# EAGLE design Multimodal_v4 (EAGLE 8.2.2)
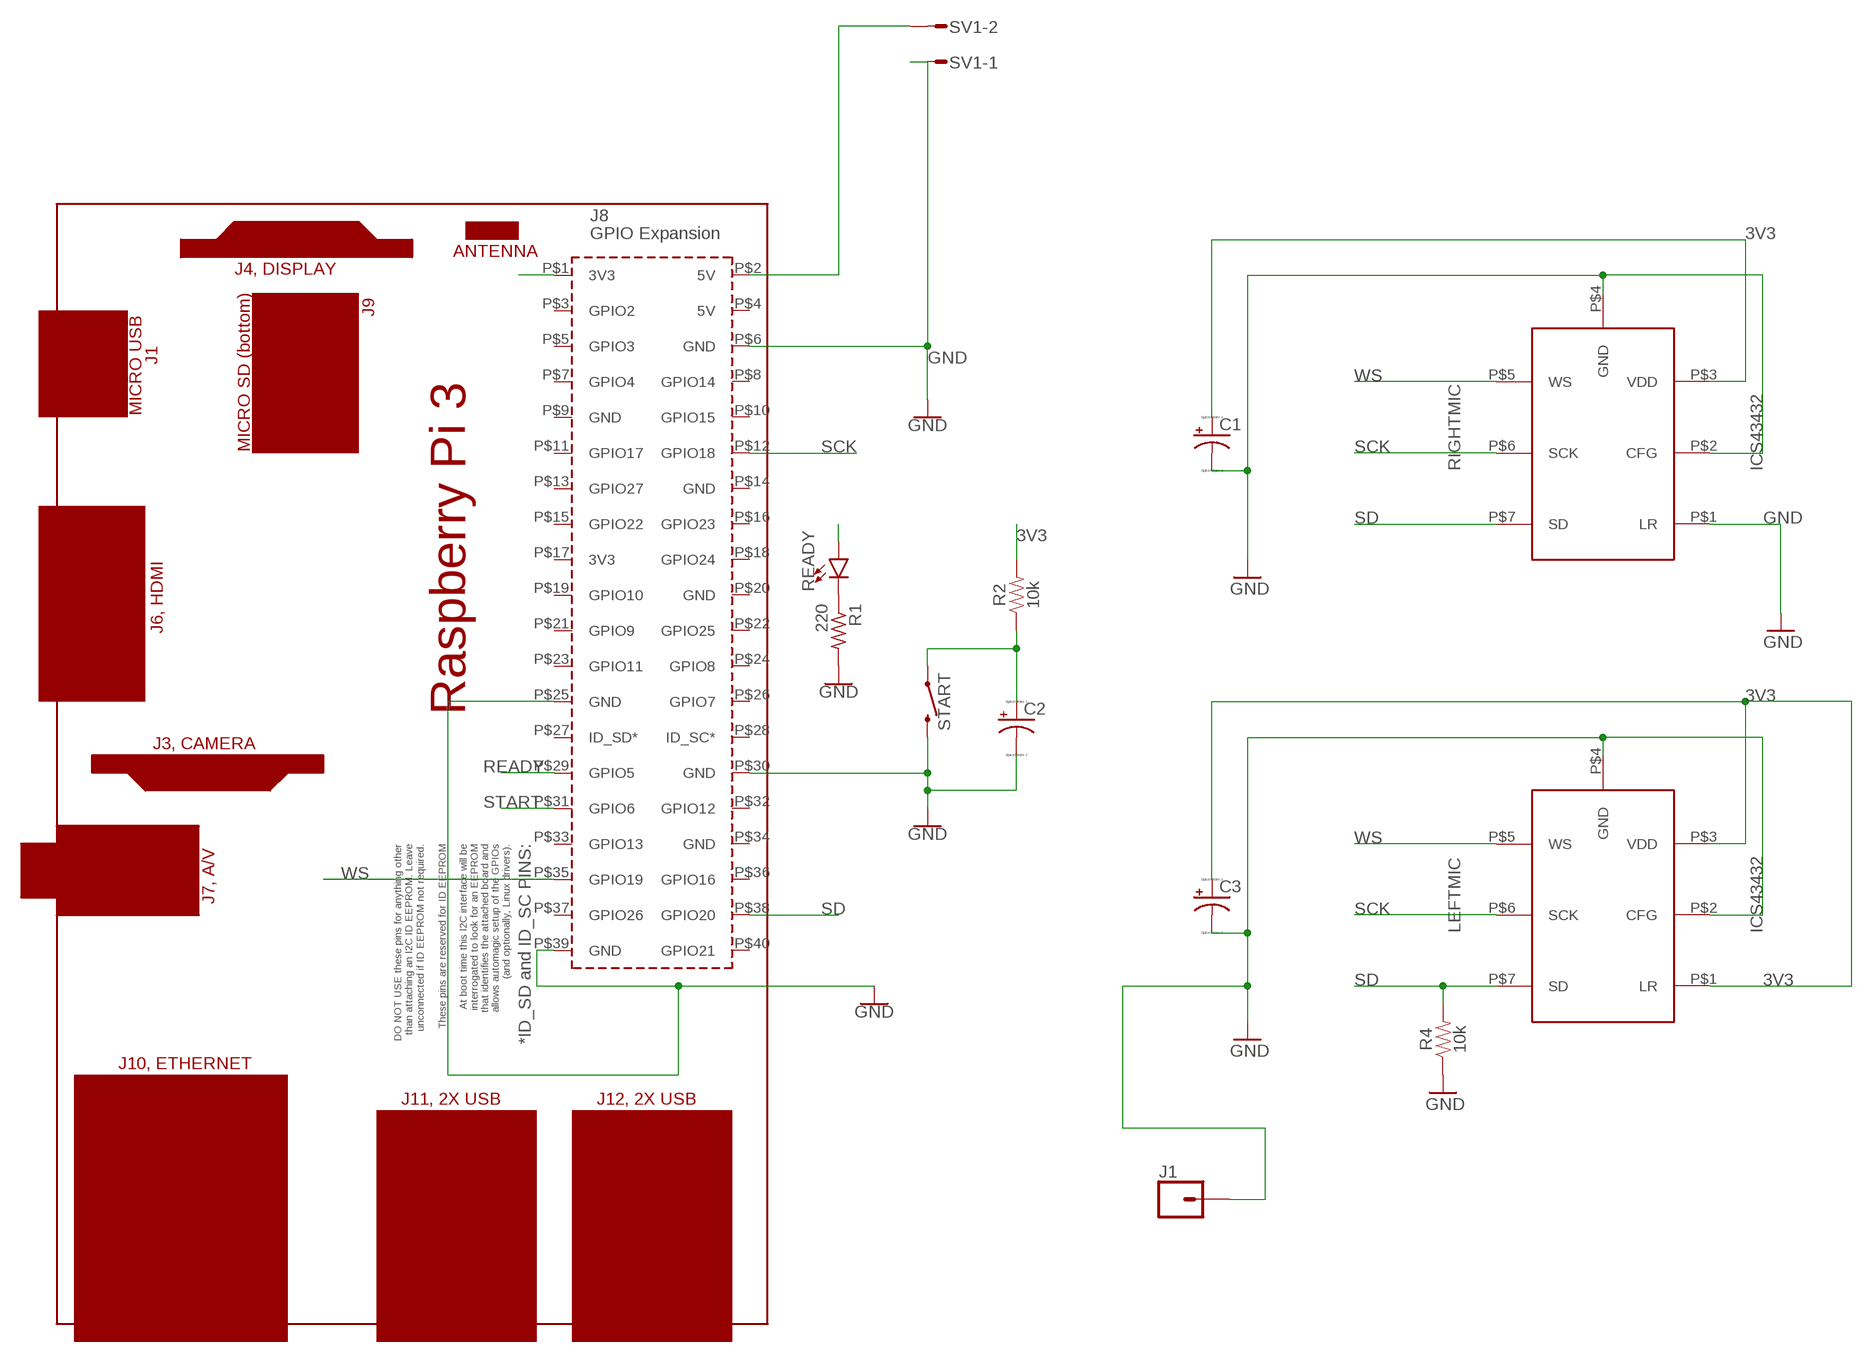
[diagram p0: schematic, sheet 1]

## Parts
C1  CPOL-USE2.5-5  [E2,5-5]
C2  CPOL-USE2.5-5  [E2,5-5]
C3  CPOL-USE2.5-5  [E2,5-5]
J1  CONN_01  [1X01]
LEFTMIC  ICS43432  [ICS43432]
PCB1  RPI3_40_PIN  [40_PIN]
R1  220  R-US_0207/7  [0207/7]
R2  10k  10KOHM-HORIZ_KIT-1/4W-5%  [AXIAL-0.3-KIT]
R4  10k  10KOHM-HORIZ_KIT-1/4W-5%  [AXIAL-0.3-KIT]
READY  LED3MM  [LED_3MM]
RIGHTMIC  ICS43432  [ICS43432]
START  MOMENTARY-SWITCH-SPST-PTH-6.0MM  [TACTILE_SWITCH_PTH_6.0MM]
SV1  L02P  [L02P]

## Nets
3V3: C1.+ C3.+ LEFTMIC.P$1(LR) LEFTMIC.P$3(VDD) PCB1.P$1(3V3) R2.P$2 RIGHTMIC.P$3(VDD)
GND: C1.- C2.- C3.- J1.1 LEFTMIC.P$2(CFG) LEFTMIC.P$4(GND) PCB1.P$6(GND) PCB1.P$25(GND) PCB1.P$30(GND) PCB1.P$39(GND) R1.2 R4.P$1 RIGHTMIC.P$1(LR) RIGHTMIC.P$2(CFG) RIGHTMIC.P$4(GND) START.3 SV1.1
N$1: R1.1 READY.K(C)
N$2: PCB1.P$2(5V) SV1.2
READY: PCB1.P$29(GPIO5) READY.A
SCK: LEFTMIC.P$6(SCK) PCB1.P$12(GPIO18) RIGHTMIC.P$6(SCK)
SD: LEFTMIC.P$7(SD) PCB1.P$38(GPIO20) R4.P$2 RIGHTMIC.P$7(SD)
START: C2.+ PCB1.P$31(GPIO6) R2.P$1 START.1
WS: LEFTMIC.P$5(WS) PCB1.P$35(GPIO19) RIGHTMIC.P$5(WS)
Unconnected: PCB1.P$3(GPIO2) PCB1.P$4(5V) PCB1.P$5(GPIO3) PCB1.P$7(GPIO4) PCB1.P$8(GPIO14) PCB1.P$9(GND) PCB1.P$10(GPIO15) PCB1.P$11(GPIO17) PCB1.P$13(GPIO27) PCB1.P$14(GND) PCB1.P$15(GPIO22) PCB1.P$16(GPIO23) PCB1.P$17(3V3) PCB1.P$18(GPIO24) PCB1.P$19(GPIO10) PCB1.P$20(GND) PCB1.P$21(GPIO9) PCB1.P$22(GPIO25) PCB1.P$23(GPIO11) PCB1.P$24(GPIO8) PCB1.P$26(GPIO7) PCB1.P$27(ID_SD*) PCB1.P$28(ID_SC*) PCB1.P$32(GPIO12) PCB1.P$33(GPIO13) PCB1.P$34(GND) PCB1.P$36(GPIO16) PCB1.P$37(GPIO26) PCB1.P$40(GPIO21)

## Library data of the parts
C1-C3 = resistor:CPOL-US: POLARIZED CAPACITOR, American symbol
J1 = SparkFun-Connectors:CONN_01: Single connection point. Often used as Generic Header-pin footprint for 0.1 inch spaced/style header connections On any of the 0.1 inch spaced packages, you can populate with these: Break Away Headers - Straight <https://www.sparkfun.com/products/116> (PRT-00116) Break Away Male Headers - Right Angle <https://www.sparkfun.com/products/553> (PRT-00553) Female Headers <https://www.sparkfun.com/products/115> (PRT-00115) Break Away Headers - Machine Pin <https://www.sparkfun.com/products/117> (PRT-00117) Break Away Female Headers - Swiss Machine Pin <https://www.sparkfun.com/products/743> (PRT-00743) This device is also useful as a general connection point to wire up your design to another part of your project. Our various solder wires solder well into these plated through hole pads. Hook-Up Wire - Assortment (Stranded, 22 AWG) <https://www.sparkfun.com/products/11375> (PRT-11375) Hook-Up Wire - Assortment (Solid Core, 22 AWG) <https://www.sparkfun.com/products/11367> (PRT-11367) View the entire wire category on our website here <https://www.sparkfun.com/categories/141> Special notes: SMTSO-256-ET is a "flush mount" nut for a 4-40 screw. We mostly use this on specialty testbeds; it is a nice way to connect hardware to your PCB at an adjustable hieght. Also note, the SNAP packages are for using a snappable style connector. We sell a baggie of snaps and they are also used on two LilyPad designs: Snap Assortment - 30 pack (male and female) <https://www.sparkfun.com/products/11347> (DEV-11347) LilyPad Arduino SimpleSnap <https://www.sparkfun.com/products/10941> (DEV-10941) LilyPad SimpleSnap Protoboard <https://www.sparkfun.com/products/10940> (DEV-10940)
LEFTMIC RIGHTMIC = Kris:ICS43432
PCB1 = e14_Rpi3_RevA:RPI3_40_PIN: Device for Raspberry Pi 3 without an associated 40 pin header package created by Dave Young for www.element14.com.
R1 = resistor:R-US_: RESISTOR, American symbol
R2 R4 = SparkFun-Resistors:10KOHM: 10kΩ resistor A resistor is a passive two-terminal electrical component that implements electrical resistance as a circuit element. Resistors act to reduce current flow, and, at the same time, act to lower voltage levels within circuits. - Wikipedia; PROD_ID: RES-09435
READY = SparkFun-LED:LED: LED (Generic) Standard schematic elements and footprints for 5mm, 3mm, 1206, and 0603 sized LEDs. Generic LEDs with no color specified.; PROD_ID: DIO-08794
START = SparkFun-Switches:MOMENTARY-SWITCH-SPST: Momentary Switch (Pushbutton) - SPST Normally-open (NO) SPST momentary switches (buttons, pushbuttons). Variants PTH-12MM - 12mm square, through-hole Momentary Pushbutton Switch - 12mm Square <https://www.sparkfun.com/products/9190> (COM-09190) PTH-6.0MM, PTH-6.0MM-KIT - 6.0mm square, through-hole Mini Pushbutton Switch <https://www.sparkfun.com/products/97> (COM-00097) KIT package intended for soldering kit's - only one side of pads' copper is exposed. PTH-RIGHT-ANGLE-KIT - Right-angle, through-hole Right Angle Tactile Button <https://www.sparkfun.com/products/10791> - Used on SparkFun BigTime Watch Kit <https://www.sparkfun.com/products/11734> SMD-12MM - 12mm square, surface-mount Tactile Button - SMD (12mm) <https://www.sparkfun.com/products/12993> (COM-12993) Used on SparkFun PicoBoard <https://www.sparkfun.com/products/11888> SMD-4.5MM - 4.5mm Square Trackball Switch Used on SparkFun Blackberry Trackballer Breakout <https://www.sparkfun.com/products/13169> SMD-4.6MMX2.8MM - 4.60mm x 2.80mm, surface mount Used on SparkFun SAMD21 Mini Breakout <https://www.sparkfun.com/products/13664> SMD-5.2MM, SMD-5.2-REDUNDANT - 5.2mm square, surface-mount Mini Pushbutton Switch - SMD <https://www.sparkfun.com/products/8720> (COM-08720) Used on Arduino Pro Mini <https://www.sparkfun.com/products/11114> REDUNDANT package connects both switch circuits together SMD-6.0X3.5MM - 6.0 x 3.5mm, surface mount Momentary Reset Switch SMD <https://www.sparkfun.com/products/8229> (COM-08229) SMD-6.2MM-TALL - 6.2mm square, surface mount Tactile Button - SMD (6mm) <https://www.sparkfun.com/products/12992> Used on SparkFun Digital Sandbox <https://www.sparkfun.com/products/12651> SMD-RIGHT-ANGLE - Right-angle, surface mount Used on SparkFun Block for Intel® Edison - Arduino <https://www.sparkfun.com/products/13036>; PROD_ID: SWCH-08441; SF_SKU: COM-00097
SV1 = con-amp-mt:L02P: AMP MT CONNECTOR; OC_FARNELL: unknown; OC_NEWARK: unknown

## Net classes
0 default: clearance 0.205 mm

## Board
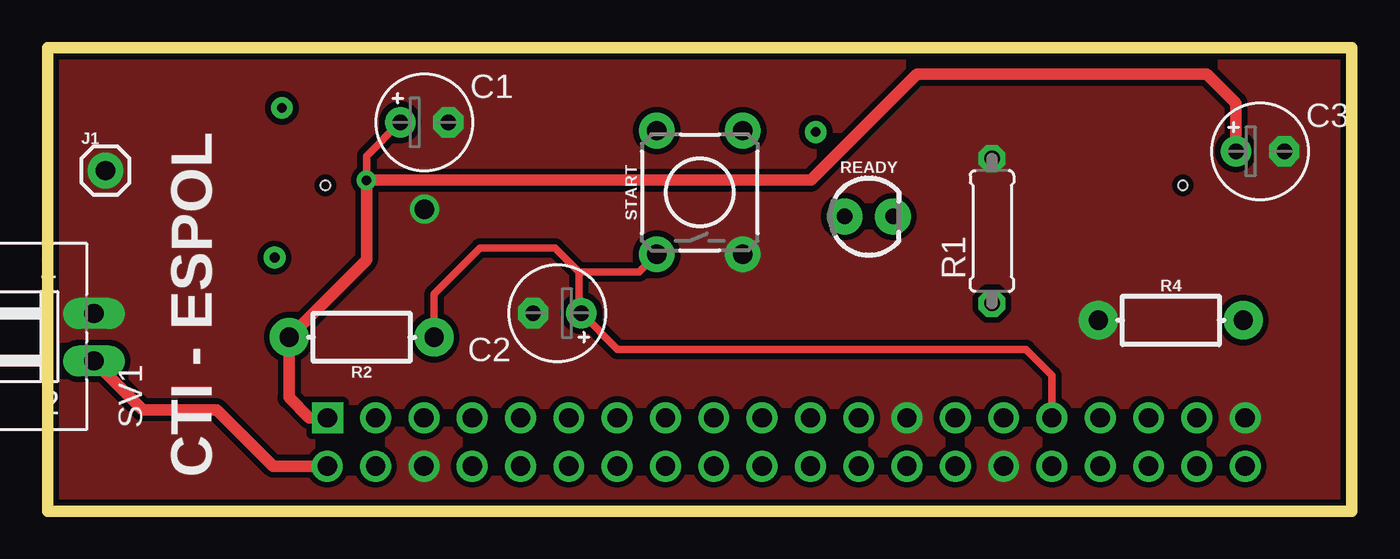
[diagram p1: board, top side]
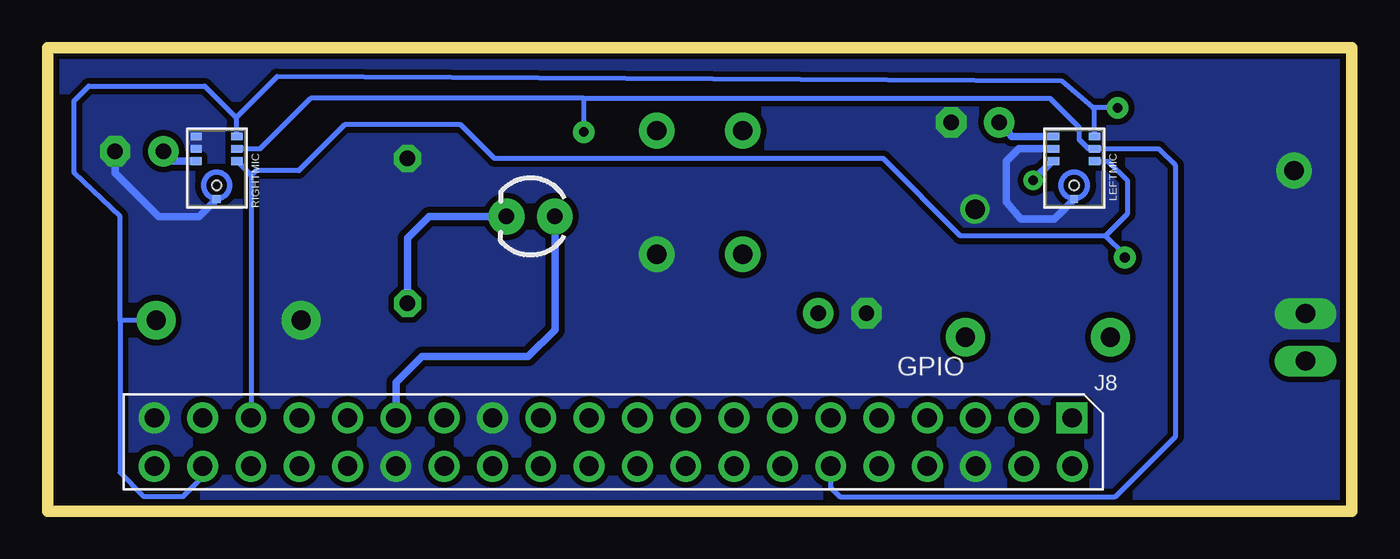
[diagram p2: board, bottom side, seen from below]

Size 68.58 x 24.38 mm. Coordinates in mm from the lower left corner, seen from the top.
Outline: 0,24.38 68.58,24.38 68.58,0 0,0 0,24.38
Copper layers (1*16): Top 0.035mm / dielectric 1.5mm / Bottom 0.035mm
Design rules "SparkFun": minimum track width 8mil, minimum drill 20mil, track to track 8mil, track to pad 8mil, pad to pad 8mil, via to via 8mil, smd to smd 8mil, copper to edge 8mil, drill to drill 8mil, minimum pad ring 12mil, minimum via ring 10mil, stop-mask expansion 4mil, vias tented up to drill 20mil, thermal gap 10mil

### Footprints (pad centres in the part's own frame; a part is rotated, then mirrored left to right if it is on the bottom)
E2,5-5 = drill 0.813 pad 1.6: + -1.27,0 | drill 0.813 pad 1.6 octagon: - 1.27,0
1X01 = drill 1.016 pad 1.88: 1 0,0
ICS43432 = smd 0.4 x 0.6: P$1 -1.675,-1.075; P$2 -1.025,-1.075; P$3 -0.375,-1.075; P$5 -0.375,1.075; P$6 -1.025,1.075; P$7 -1.675,1.075 | smd 0.4 x 0.4: P$4 1.62,0 | hole 0.5: 0.9,0
40_PIN = drill 1.016 square: P$1 2.02,1.7 | drill 1.016: P$2 2.007,4.242; P$3 4.547,1.702; P$4 4.547,4.242; P$5 7.087,1.702; P$6 7.087,4.242; P$7 9.627,1.702; P$8 9.627,4.242; P$9 12.167,1.702; P$10 12.167,4.242; P$11 14.707,1.702; P$12 14.707,4.242; P$13 17.247,1.702; P$14 17.247,4.242; P$15 19.787,1.702; P$16 19.787,4.242; P$17 22.327,1.702; P$18 22.327,4.242; P$19 24.867,1.702; P$20 24.867,4.242; P$21 27.407,1.702; P$22 27.407,4.242; P$23 29.947,1.702; P$24 29.947,4.242; P$25 32.487,1.702; P$26 32.487,4.242; P$27 35.027,1.702; P$28 35.027,4.242; P$29 37.567,1.702; P$30 37.567,4.242; P$31 40.107,1.702; P$32 40.107,4.242; P$33 42.647,1.702; P$34 42.647,4.242; P$35 45.187,1.702; P$36 45.187,4.242; P$37 47.727,1.702; P$38 47.727,4.242; P$39 50.267,1.702; P$40 50.267,4.242
0207/7 = drill 0.813 octagon: 1 -3.81,0; 2 3.81,0
AXIAL-0.3-KIT = drill 1.016 pad 2.032: P$1 -3.81,0; P$2 3.81,0
LED_3MM = drill 0.813 pad 1.88: A -1.27,0; K 1.27,0
TACTILE_SWITCH_PTH_6.0MM = drill 1.016 pad 1.88: 1 -3.251,2.261; 2 3.251,2.261; 3 -3.251,-2.261; 4 3.251,-2.261
L02P = drill 1.016 long: 1 1.25,-6.25; 2 -1.25,-6.25

### Placement (x,y rotation side)
C1  19.81,20.45 0 top
C2  26.8,10.41 180 top
C3  63.75,18.92 0 top
J1  3.05,17.91 0 top
LEFTMIC  14.61,18.03 270 bottom
PCB1  12.7,6.6 180 bottom
R1  49.66,14.73 90 top
R2  16.51,9.14 180 top
R4  59.05,10.03 0 top
READY  43.18,15.49 0 top
RIGHTMIC  59.69,18.03 270 bottom
START  34.29,16.76 90 top
SV1  -3.81,9.14 90 top

### Tracks (layer width: path | path; a pad name or v marks a point on that pad's centre or on a via)
3V3  (via drill 0.51)
  Top 0.406: v16.76,17.4 16.76,18.67 C1.+
  Top 0.61: PCB1.P$1 13.77,4.9 12.7,5.97 R2.P$2 16.76,13.21 v16.76,17.4 40.13,17.4 45.72,22.99 60.96,22.99 62.48,21.46 C3.+
  Bottom 0.406: LEFTMIC.P$1 17.88,19.71 C1.+ | LEFTMIC.P$3 15.75,18.41 v16.76,17.4 | RIGHTMIC.P$3 61.97,18.41 C3.+
GND  (via drill 1.02)
  Bottom 0.406: LEFTMIC.P$2 17.52,19.06 18.16,18.41 18.16,16.26 17.4,15.37 15.65,15.37 LEFTMIC.P$4 | C3.- 65.02,17.78 62.74,15.49 60.61,15.49 RIGHTMIC.P$4
  Bottom 0.61: 19.81,2.34 PCB1.P$6
  other vias: 19.81,15.88
  pour Top (isolate 0.305, no thermals): 0,24.38 68.58,24.51 68.45,-0.25 -0.13,-0.13
  pour Bottom (isolate 0.305, no thermals): 0.13,24.38 68.45,24.26 68.71,-0.38 0,-0.13
N$1
  Bottom 0.406: READY.K 48.51,15.49 49.66,14.35 R1.1
N$2
  Top 0.61: PCB1.P$2 11.86,2.36 8.89,5.33 5,5.33 SV1.2
READY
  Bottom 0.406: PCB1.P$29 50.27,6.76 48.9,8.13 43.31,8.13 41.91,9.53 READY.A
SCK  (via drill 0.51 pad 1.15)
  Bottom 0.254: PCB1.P$12 27.41,1.25 26.92,0.76 12.45,0.76 9.27,3.94 9.27,18.16 10.16,19.05 LEFTMIC.P$6 13.84,19.05 14.35,19.56 14.35,20.19 15.88,21.72 40.38,21.72 | RIGHTMIC.P$6 57.4,19.06 54.74,21.72 40.38,21.72 | v40.39,19.94 40.39,21.72 40.38,21.72
SD  (via drill 0.51 pad 1.15)
  Bottom 0.254: PCB1.P$38 60.43,1.8 61.47,0.76 63.5,0.76 64.77,2.03 64.77,10.03 | 64.77,10.03 64.77,15.49 67.18,17.78 67.18,21.59 66.42,22.35 60.32,22.35 58.67,20.7 | 58.67,20.7 58.67,19.77 RIGHTMIC.P$7 | LEFTMIC.P$7 13.53,21.15 13.64,21.24 | 13.64,21.24 15.24,22.61 56.51,22.86 58.67,20.7 | R4.P$2 64.77,10.03 | v12.32,21.21 13.61,21.21 13.64,21.24
START
  Top 0.406: R2.P$1 20.32,11.43 22.73,13.84 26.67,13.84 27.94,12.57 | 27.94,12.57 27.94,10.54 C2.+ 29.97,8.51 51.44,8.51 52.81,7.14 PCB1.P$31 | 27.94,12.57 31.09,12.57 START.1
WS  (via drill 0.51 pad 1.15)
  Bottom 0.254: 57.89,17.64 PCB1.P$35 | 57.89,17.64 57.89,17.68 RIGHTMIC.P$5 | LEFTMIC.P$5 12.82,18.41 11.81,17.4 11.81,15.62 12.95,14.48 | 12.95,14.48 20.57,14.48 24.64,18.54 45.09,18.54 46.86,20.32 52.96,20.32 55.37,17.91 57.62,17.91 57.89,17.64 | v11.94,13.34 11.94,13.46 12.95,14.48

### Text on the board
tPlace: CTI - ESPOL